# EAGLE design LB_BIT_i5_SLIDEDIMMER-v02(rev1) (EAGLE 6.6.0)
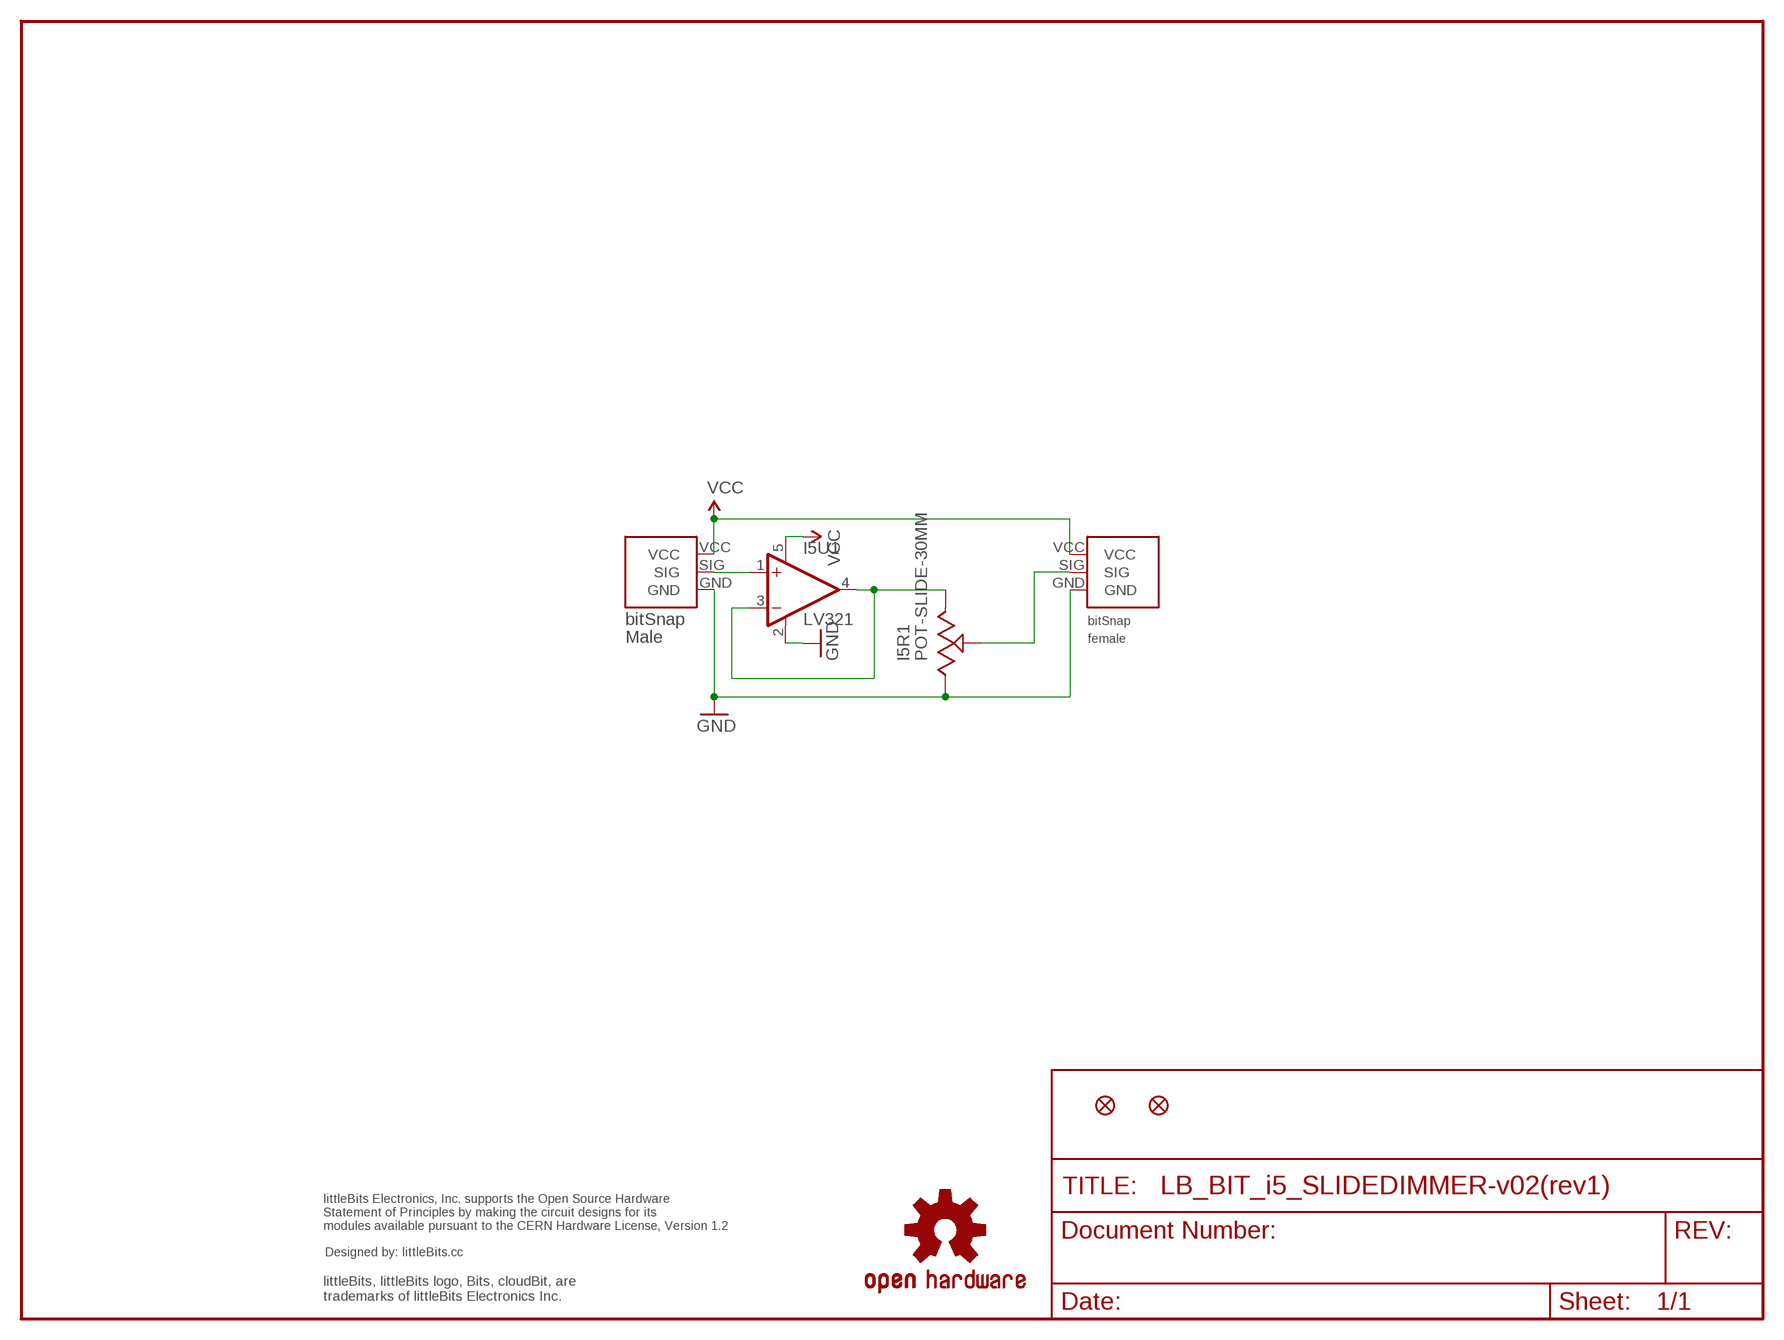
[diagram p0: schematic, sheet 1]

## Parts
I5BSF  BITSNAP_FEMALE  [BITSNAP_FEMALE]
I5BSM  BITSNAP_MALE  [BITSNAP_MALE]
I5FD1  FIDUCIAL1X2  [FIDUCIAL-1X2]
I5FD2  FIDUCIAL1X2  [FIDUCIAL-1X2]
I5R1  POT-SLIDE-30MM  [POT-SLIDE-30MM]
I5U1  LV321  [SC70-5]
U$5  OSHW-LOGOL  [OSHW-LOGO-L]
U$6  OSHWCREDIT  [OSHWCREDIT]

## Nets
GND: I5BSF.GND I5BSM.GND I5R1.3 I5U1.2(V-)
N$1: I5R1.1 I5U1.3(-IN) I5U1.4(OUT)
N$5: I5BSM.SIG I5U1.1(+IN)
POT: I5BSF.SIG I5R1.2
VCC: I5BSF.VCC I5BSM.VCC I5U1.5(V+)

## Library data of the parts
I5BSF = bitSnap:BITSNAP_FEMALE
I5BSM = bitSnap:BITSNAP_MALE
I5FD1 I5FD2 = SparkFun:FIDUCIAL: Fiducial Alignment Points Various fiducial points for machine vision alignment.
I5R1 = LITTLEBITS:POT-SLIDE-30MM: Pot-Slide-30mm TT Elect. PS30-10PB10BR10K
I5U1 = LITTLEBITS:LV321
U$5 = SparkFun_NEW:OSHW-LOGO: Open Source Hardware Logo This logo indicates the piece of hardware it is found on incorporates a OSHW license and/or adheres to the definition of open source hardware found here: http://freedomdefined.org/OSHW
U$6 = LITTLEBITS:OSHWCREDIT

## Board
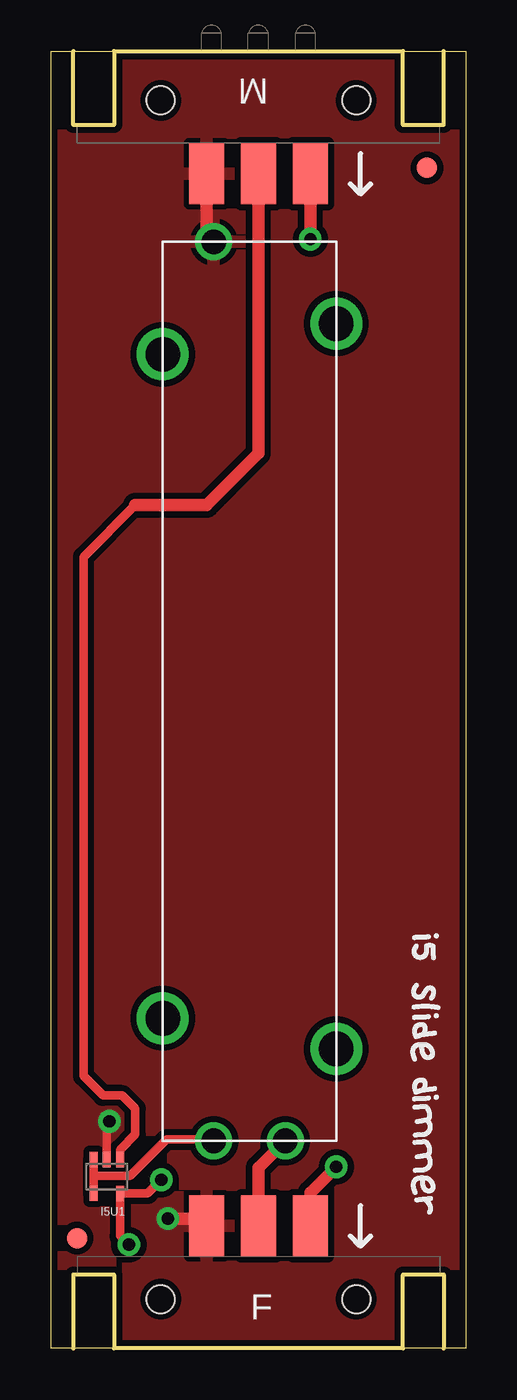
[diagram p1: board, top side]
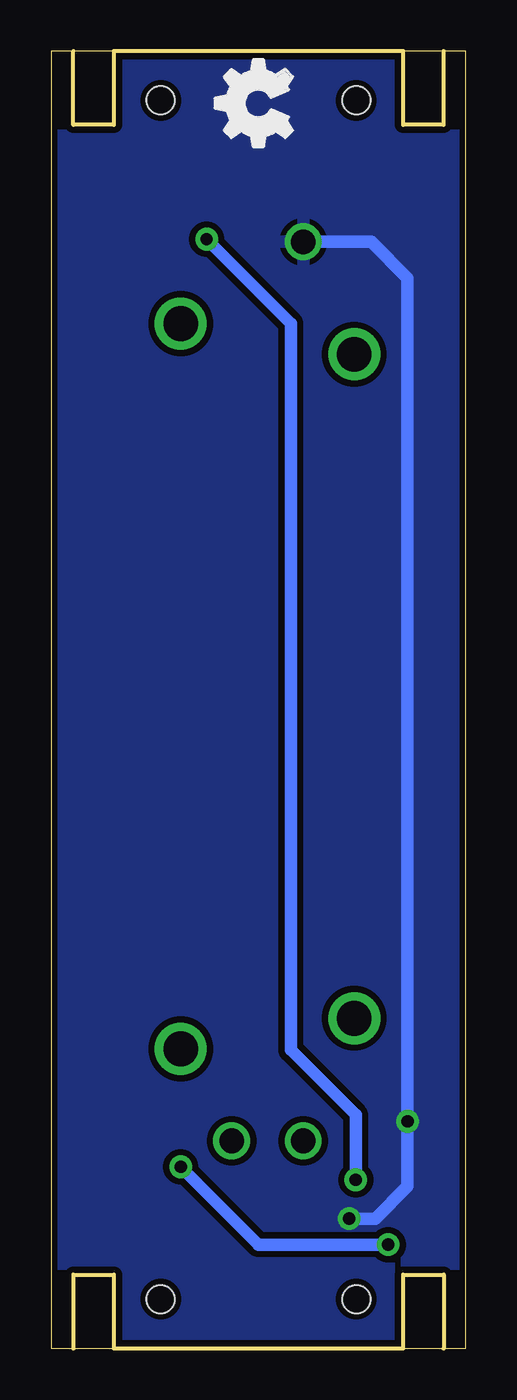
[diagram p2: board, bottom side, seen from below]

Size 20.32 x 63.5 mm. Coordinates in mm from the lower left corner, seen from the top.
Outline: 0,0 0,63.5 20.32,63.5 20.32,0 0,0
Copper layers (1*16): Top 0.035mm / dielectric 1.5mm / Bottom 0.035mm
Design rules "default": minimum track width 8mil, minimum drill 20mil, track to track 8mil, track to pad 8mil, pad to pad 8mil, via to via 8mil, smd to smd 8mil, copper to edge 10mil, drill to drill 8mil, minimum pad ring 12mil, minimum via ring 10mil, stop-mask expansion 4mil, vias tented up to drill 25mil, thermal gap 10mil

### Footprints (pad centres in the part's own frame; a part is rotated, then mirrored left to right if it is on the bottom)
BITSNAP_FEMALE = smd 1.7 x 3: GND 6.35,6; SIG 8.89,6; VCC 11.43,6 | hole 1.37: 13.68,2.41; 4.1,2.41
BITSNAP_MALE = smd 1.7 x 3: GND 11.43,6; SIG 8.89,6; VCC 6.35,6 | hole 1.37: 13.68,2.41; 4.1,2.41
FIDUCIAL-1X2 = smd 1 x 1: 1 0,0
POT-SLIDE-30MM = drill 1.2: 1 0,6; 2 0,2.5; 3 44,6 | drill 1.7: P$4 6,8.5; P$5 4.5,0; P$6 40,0; P$7 38.5,8.5
SC70-5 = smd 0.4 x 0.75: 1 -0.65,-0.825; 2 0,-0.825; 3 0.65,-0.825; 4 0.65,0.825; 5 -0.65,0.825

### Placement (x,y rotation side)
I5BSF  1.27,0 0 top
I5BSM  19.05,63.5 180 top
I5FD1  18.41,57.78 0 top
I5FD2  1.27,5.4 0 top
I5R1  13.97,10.16 90 top
I5U1  2.73,8.41 180 top
U$1  [I]  17.55,20.42 270 top
U$2  [5]  17.42,19.96 270 top
U$3  [S]  17.55,18.01 270 top
U$4  [L]  17.55,16.97 270 top
U$5  -13.97,-11.43 0 top  (outside the outline)
U$6  -17.78,-24.13 0 top  (outside the outline)
U$7  [OSHW_FILLX150_NOTEXT]  8.49,57.99 0 top
U$9  [I]  17.55,16.51 270 top
U$10  [D]  17.55,16.05 270 top
U$11  [E]  17.42,15.21 270 top
U$12  [D]  17.55,13.34 270 top
U$13  [I]  17.55,12.52 270 top
U$14  [M]  17.68,12.19 270 top
U$15  [M]  17.68,10.46 270 top
U$16  [E]  17.45,8.69 270 top
U$17  [R]  17.6,7.7 270 top

### Tracks (layer width: path | path; a pad name or v marks a point on that pad's centre or on a via)
GND  (via drill 0.6 pad 1.02)
  Top 0.406: 2.73,10.98 I5U1.2
  Top 0.61: v2.86,11.11 2.73,10.98 | v5.71,6.35 7.27,6.35 I5BSF.GND | I5BSM.GND 7.62,54.51 I5R1.3
  Bottom 0.61: v5.71,6.35 4.45,6.35 2.86,7.94 v2.86,11.11 2.86,52.39 4.63,54.16 I5R1.3
  pour Top (isolate 0.305): 0.32,63.18 20,63.18 20,0.32 0.32,0.32
  pour Bottom (isolate 0.305): 0.32,63.18 20,63.18 20,0.32 0.32,0.32
N$1
  Top 0.406: I5U1.4 2.08,8.43 | 2.08,8.43 I5U1.3 | 5.4,9.97 3.87,8.44 2.09,8.44 2.08,8.43 | 5.4,9.97 | 5.4,9.97 5.66,10.23 7.9,10.23 I5R1.1
N$5
  Top 0.406: 4.13,41.27 1.59,38.73 1.59,13.34 2.54,12.38 3.49,12.38 4.13,11.75 4.13,10.48 3.38,9.73 I5U1.1
  Top 0.61: 4.13,41.27 7.62,41.27 10.16,43.81 I5BSM.SIG
POT
  Top 0.61: I5BSF.SIG 10.16,8.85 I5R1.2
VCC  (via drill 0.6 pad 1.02)
  Top 0.406: v3.81,5.08 3.38,5.51 I5U1.5 4.73,7.59 v5.4,8.26
  Top 0.61: v3.81,5.08 3.68,5.21 | v13.97,8.89 12.7,7.62 I5BSF.VCC | v12.7,54.29 I5BSM.VCC
  Bottom 0.61: v3.81,5.08 10.16,5.08 v13.97,8.89 | v5.4,8.26 5.4,11.43 8.57,14.61 8.57,50.16 v12.7,54.29